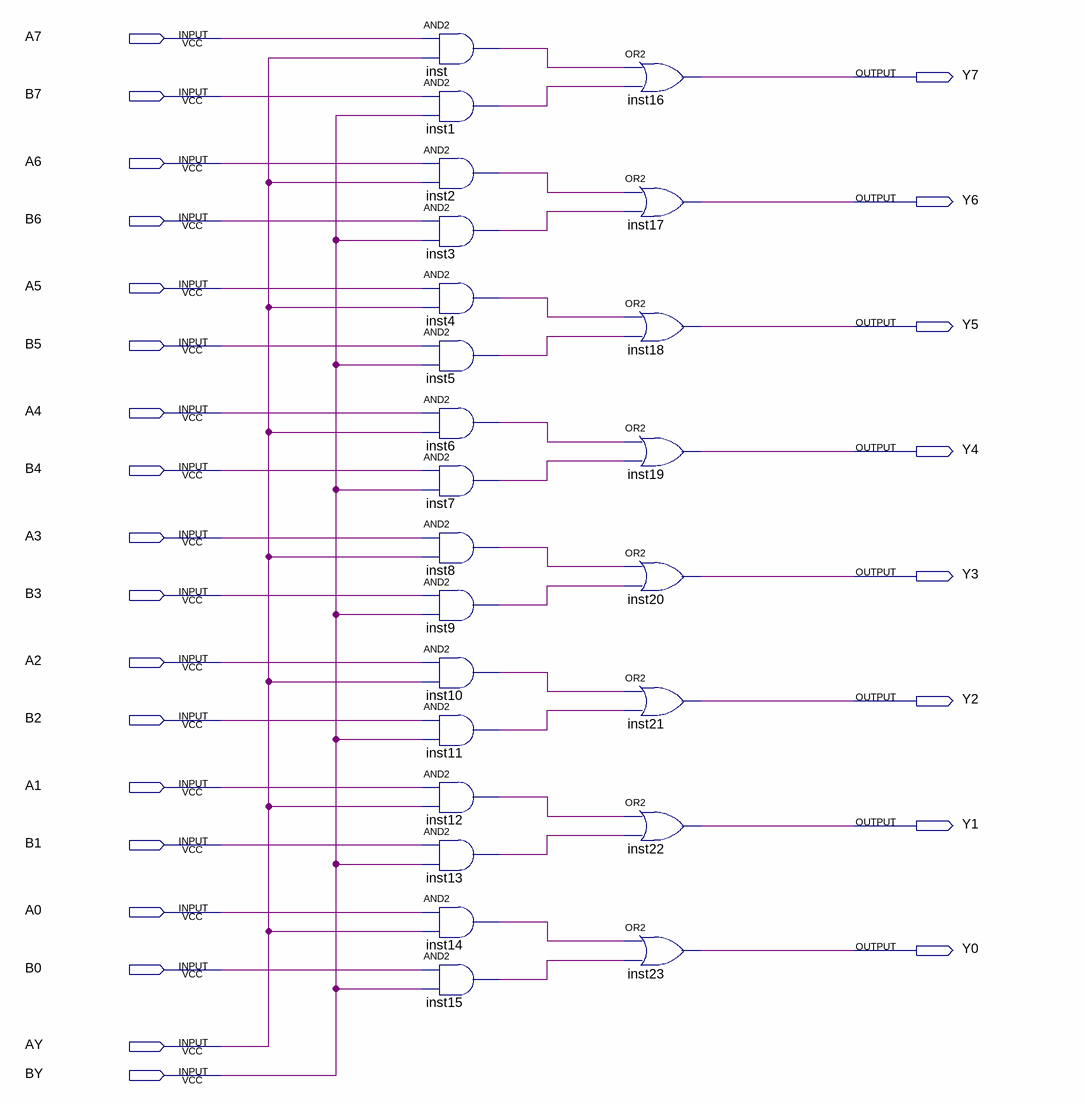
[diagram p0: schematic sheet]
// Quartus schematic select-2.bdf as structural Verilog: 24 symbols, 26 pins
module \select-2  (
  input  A7,
  input  B7,
  input  A6,
  input  B6,
  input  A5,
  input  B5,
  input  A4,
  input  B4,
  input  A3,
  input  B3,
  input  A2,
  input  B2,
  input  A1,
  input  B1,
  input  A0,
  input  B0,
  input  AY,
  input  BY,
  output Y7,
  output Y6,
  output Y5,
  output Y4,
  output Y3,
  output Y2,
  output Y1,
  output Y0
);

  wire inst1_out, inst2_out, inst3_out, inst4_out, inst5_out, inst6_out, inst7_out, inst8_out, inst9_out,
       inst10_out, inst11_out, inst12_out, inst13_out, inst14_out, inst15_out, inst_out;

  and inst (inst_out, A7, AY);
  and inst1 (inst1_out, B7, BY);
  and inst2 (inst2_out, A6, AY);
  and inst3 (inst3_out, B6, BY);
  and inst4 (inst4_out, A5, AY);
  and inst5 (inst5_out, B5, BY);
  and inst6 (inst6_out, A4, AY);
  and inst7 (inst7_out, B4, BY);
  and inst8 (inst8_out, A3, AY);
  and inst9 (inst9_out, B3, BY);
  and inst10 (inst10_out, A2, AY);
  and inst11 (inst11_out, B2, BY);
  and inst12 (inst12_out, A1, AY);
  and inst13 (inst13_out, B1, BY);
  and inst14 (inst14_out, A0, AY);
  and inst15 (inst15_out, B0, BY);
  or inst16 (Y7, inst_out, inst1_out);
  or inst17 (Y6, inst2_out, inst3_out);
  or inst18 (Y5, inst4_out, inst5_out);
  or inst19 (Y4, inst6_out, inst7_out);
  or inst20 (Y3, inst8_out, inst9_out);
  or inst21 (Y2, inst10_out, inst11_out);
  or inst22 (Y1, inst12_out, inst13_out);
  or inst23 (Y0, inst14_out, inst15_out);
endmodule
